# EAGLE schematic RejsaCAN v3.4 (EAGLE 9.7.0)
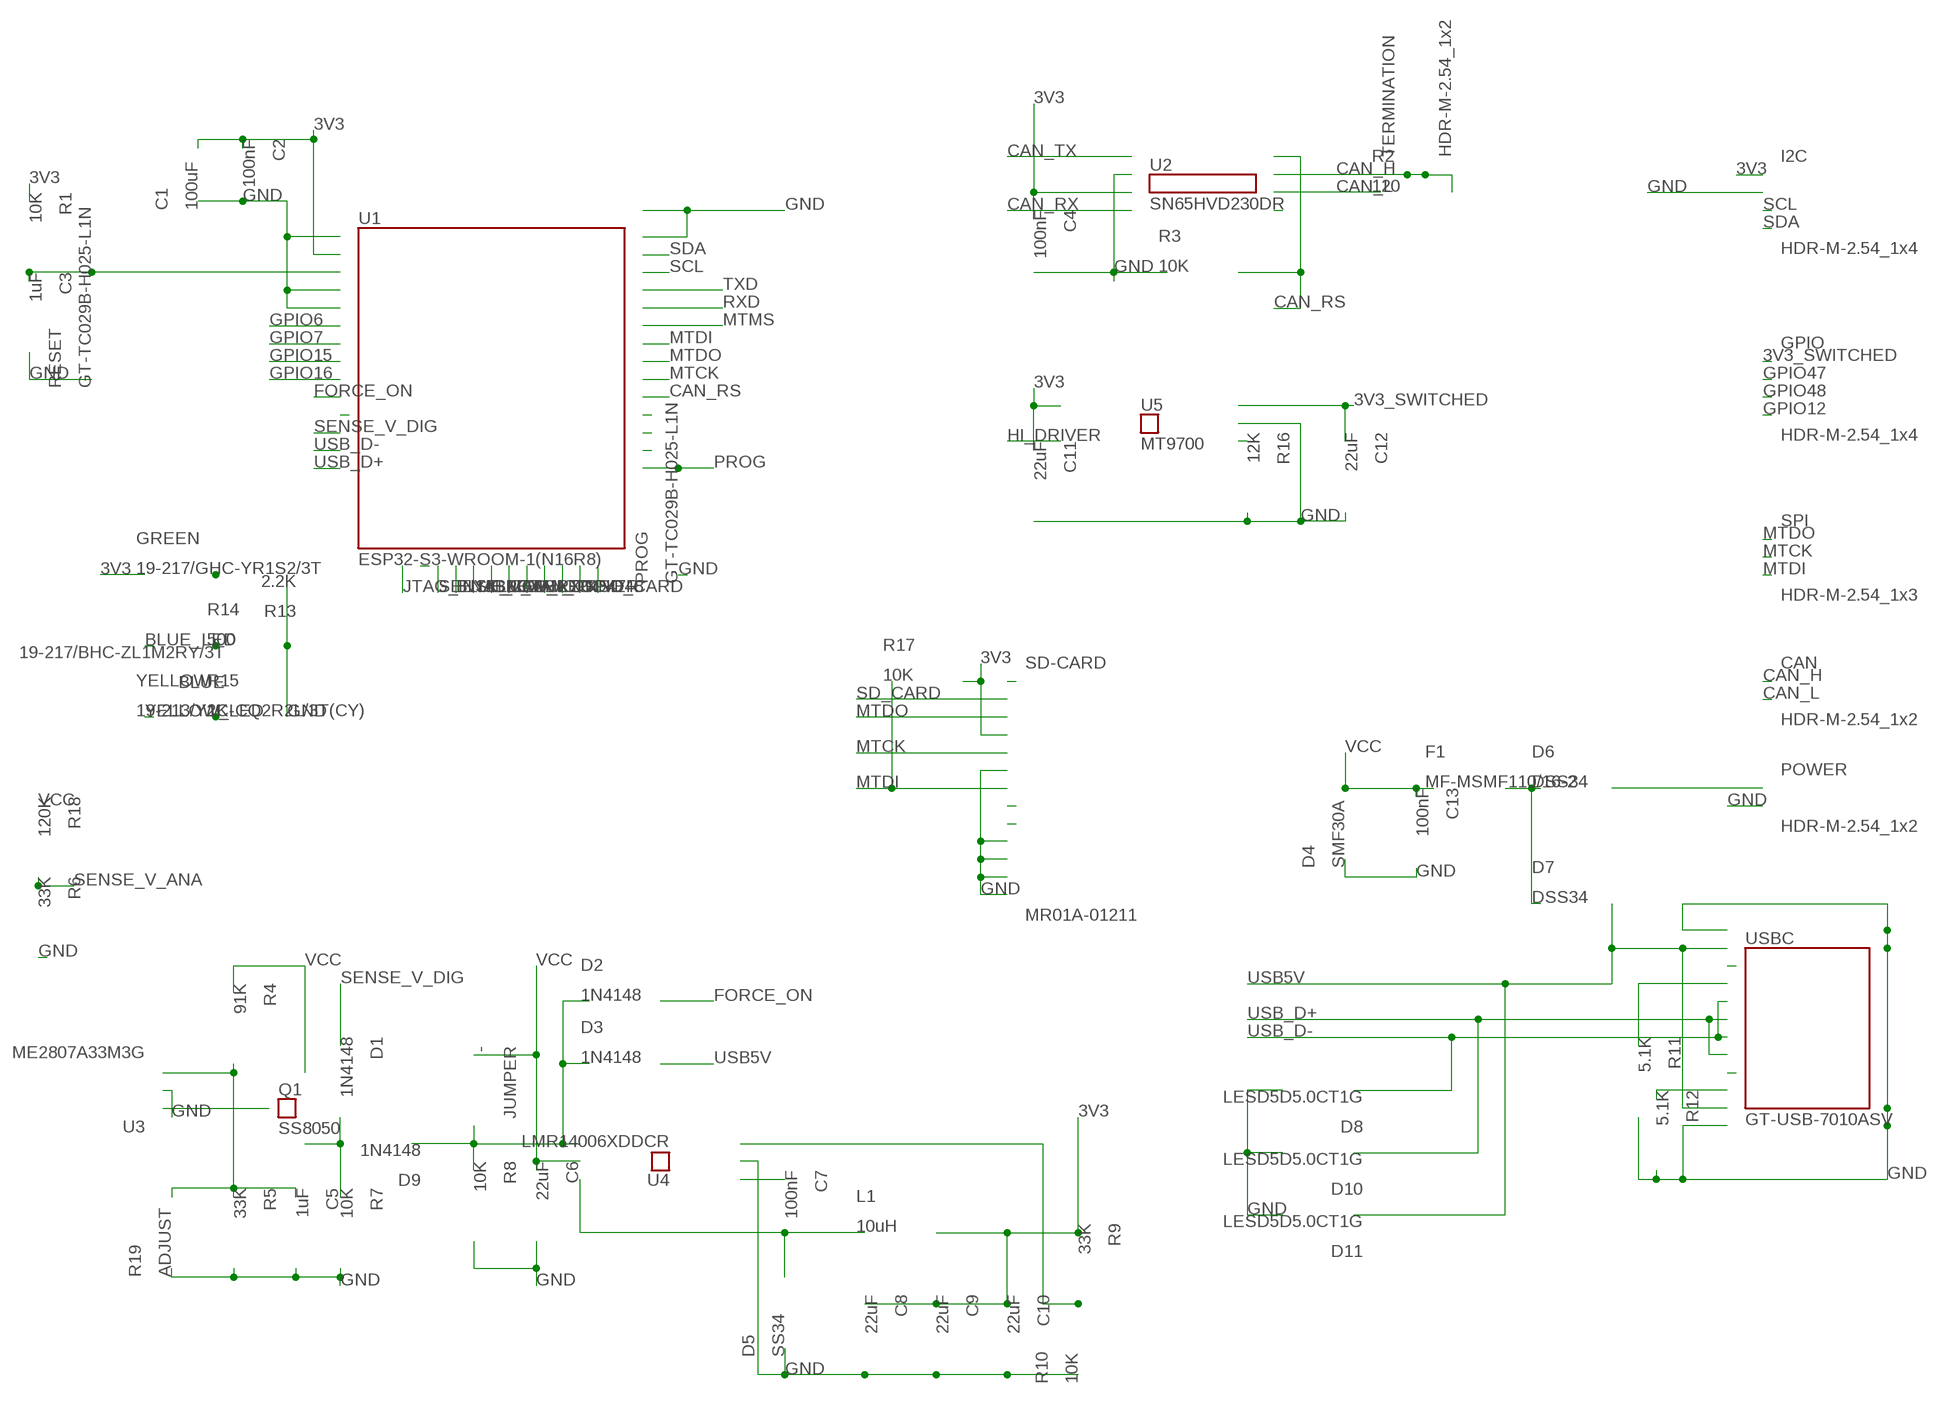
[diagram p0: schematic, sheet 1]

## Parts
BLUE  19-217/BHC-ZL1M2RY/3T  DS_BLUE  (no package)
C1  100uF  DS_C1  (no package)
C2  100nF  DS_C2  (no package)
C3  1uF  DS_C3  (no package)
C4  100nF  DS_C4  (no package)
C5  1uF  DS_C5  (no package)
C6  22uF  DS_C6  (no package)
C7  100nF  DS_C7  (no package)
C8  22uF  DS_C8  (no package)
C9  22uF  DS_C9  (no package)
C10  22uF  DS_C10  (no package)
C11  22uF  DS_C11  (no package)
C12  22uF  DS_C12  (no package)
C13  100nF  DS_C13  (no package)
CAN  HDR-M-2.54_1x2  DS_CAN  (no package)
D1  1N4148  DS_D1  (no package)
D2  1N4148  DS_D2  (no package)
D3  1N4148  DS_D3  (no package)
D4  SMF30A  DS_D4  (no package)
D5  SS34  DS_D5  (no package)
D6  DSS34  DS_D6  (no package)
D7  DSS34  DS_D7  (no package)
D8  LESD5D5.0CT1G  DS_D8  (no package)
D9  1N4148  DS_D9  (no package)
D10  LESD5D5.0CT1G  DS_D10  (no package)
D11  LESD5D5.0CT1G  DS_D11  (no package)
F1  MF-MSMF110/16-2  DS_F1  (no package)
GPIO  HDR-M-2.54_1x4  DS_GPIO  (no package)
GREEN  19-217/GHC-YR1S2/3T  DS_GREEN  (no package)
I2C  HDR-M-2.54_1x4  DS_I2C  (no package)
JUMPER  -  DS_JUMPER  (no package)
L1  10uH  DS_L1  (no package)
POWER  HDR-M-2.54_1x2  DS_POWER  (no package)
PROG  GT-TC029B-H025-L1N  DS_PROG  (no package)
Q1  SS8050  DS_Q1  (no package)
R1  10K  DS_R1  (no package)
R2  120  DS_R2  (no package)
R3  10K  DS_R3  (no package)
R4  91K  DS_R4  (no package)
R5  33K  DS_R5  (no package)
R6  33K  DS_R6  (no package)
R7  10K  DS_R7  (no package)
R8  10K  DS_R8  (no package)
R9  33K  DS_R9  (no package)
R10  10K  DS_R10  (no package)
R11  5.1K  DS_R11  (no package)
R12  5.1K  DS_R12  (no package)
R13  2.2K  DS_R13  (no package)
R14  500  DS_R14  (no package)
R15  1K  DS_R15  (no package)
R16  12K  DS_R16  (no package)
R17  10K  DS_R17  (no package)
R18  120K  DS_R18  (no package)
R19  ADJUST  DS_R19  (no package)
RESET  GT-TC029B-H025-L1N  DS_RESET  (no package)
SD-CARD  MR01A-01211  DS_SD-CARD  (no package)
SPI  HDR-M-2.54_1x3  DS_SPI  (no package)
TERMINATION  HDR-M-2.54_1x2  DS_TERMINATION  (no package)
U1  ESP32-S3-WROOM-1(N16R8)  DS_U1  (no package)
U2  SN65HVD230DR  DS_U2  (no package)
U3  ME2807A33M3G  DS_U3  (no package)
U4  LMR14006XDDCR  DS_U4  (no package)
U5  MT9700  DS_U5  (no package)
USBC  GT-USB-7010ASV  DS_USBC  (no package)
YELLOW  19-213/Y2C-CQ2R2L/3T(CY)  DS_YELLOW  (no package)

## Nets
3V3: C1.1 C2.2 C4.2 C8.2 C9.2 C10.2 C11.2 GREEN.1 I2C.1 L1.2 R1.2 R9.2 R17.2 SD-CARD.4 U1.2 U2.3 U5.5
3V3_SWITCHED: C12.2 GPIO.1 U5.1
BLUE_LED: BLUE.1 U1.18
CAN_H: CAN.1 R2.2 TERMINATION.1 TERMINATION.2 U2.7
CAN_L: CAN.2 R2.1 U2.6
CAN_RS: R3.2 U1.31 U2.8
CAN_RX: U1.21 U2.4
CAN_TX: U1.22 U2.1
FORCE_ON: D2.2 U1.10
GND: C1.2 C2.1 C3.1 C4.1 C5.1 C6.1 C8.1 C9.1 C10.1 C11.1 C12.1 C13.1 D4.2 D5.2 D8.2 D10.2 D11.2 I2C.2 POWER.2 PROG.2 R3.1 R5.1 R6.1 R7.1 R8.1 R10.2 R11.1 R12.1 R13.1 R14.2 R15.2 R16.1 R19.2 RESET.2 SD-CARD.6 SD-CARD.10 SD-CARD.11 SD-CARD.12 SD-CARD.13 U1.1 U1.4 U1.5 U1.40 U1.41 U2.2 U3.2 U4.2 U5.2 USBC.1 USBC.2 USBC.3 USBC.4 USBC.A1B12 USBC.B1A12
GPIO6: U1.6
GPIO7: U1.7
GPIO12: GPIO.4 U1.20
GPIO15: U1.8
GPIO16: U1.9
GPIO47: GPIO.2 U1.24
GPIO48: GPIO.3 U1.25
HI_DRIVER: U1.23 U5.4
JTAG_ENABLE: U1.15
MTCK: SD-CARD.5 SPI.2 U1.32
MTDI: R17.1 SD-CARD.7 SPI.3 U1.34
MTDO: SD-CARD.3 SPI.1 U1.33
MTMS: U1.35
N$1: R15.1 YELLOW.2
N$2: D6.2 POWER.1
N$3: BLUE.2 R14.1
N$4: GREEN.2 R13.2
N$5: D1.1 D9.2 Q1.2 R7.2
N$6: C5.2 R4.1 R5.2 R19.1 U3.3
N$7: Q1.1 U3.1
N$8: C7.1 D5.1 L1.1 U4.6
N$9: R16.2 U5.3
N$10: R9.1 R10.1 U4.3
N$11: D2.1 D3.1 D9.1 JUMPER.1 R8.2 U4.4
N$12: C3.2 R1.1 RESET.1 U1.3
N$13: U2.5
N$14: D6.1 D7.1 F1.2
N$15: SD-CARD.1
N$16: SD-CARD.8
N$17: SD-CARD.9
N$18: U1.11
N$19: U1.16
N$20: U1.28
N$21: U1.29
N$22: U1.30
N$23: C7.2 U4.1
N$24: R12.2 USBC.B5
N$25: USBC.A8
N$26: R11.2 USBC.A5
N$27: USBC.B8
PROG: PROG.1 U1.27
RXD: U1.36
SCL: I2C.3 U1.38
SD_CARD: SD-CARD.2 U1.26
SDA: I2C.4 U1.39
SENSE_V_ANA: R6.2 R18.1 U1.17
SENSE_V_DIG: D1.2 U1.12
TXD: U1.37
USB5V: D3.2 D7.2 D11.1 USBC.A4B9 USBC.B4A9
USB_D+: D10.1 U1.14 USBC.A6 USBC.B6
USB_D-: D8.1 U1.13 USBC.A7 USBC.B7
VCC: C6.2 C13.2 D4.1 F1.1 JUMPER.2 Q1.3 R4.2 R18.2 U4.5
YELLOW_LED: U1.19 YELLOW.1

## Library data of the parts
BLUE = rejsacan_synth:DS_BLUE: 19-217/BHC-ZL1M2RY/3T
C1 = rejsacan_synth:DS_C1: TAJB107K006RNJ
C2 = rejsacan_synth:DS_C2: CL05B104KO5NNNC
C3 = rejsacan_synth:DS_C3: CL05A105KA5NQNC
C4 = rejsacan_synth:DS_C4: CL05B104KO5NNNC
C5 = rejsacan_synth:DS_C5: CL05A105KA5NQNC
C6 = rejsacan_synth:DS_C6: CL21A226MAYNNNE
C7 = rejsacan_synth:DS_C7: CL05B104KO5NNNC
C8 = rejsacan_synth:DS_C8: CL10A226MQ8NRNC
C9 = rejsacan_synth:DS_C9: CL10A226MQ8NRNC
C10 = rejsacan_synth:DS_C10: CL10A226MQ8NRNC
C11 = rejsacan_synth:DS_C11: CL10A226MQ8NRNC
C12 = rejsacan_synth:DS_C12: CL10A226MQ8NRNC
C13 = rejsacan_synth:DS_C13: CL05B104KB54PNC
CAN = rejsacan_synth:DS_CAN: HDR-M-2.54_1x2
D1 = rejsacan_synth:DS_D1: 1N4148WS T4
D2 = rejsacan_synth:DS_D2: 1N4148WS T4
D3 = rejsacan_synth:DS_D3: 1N4148WS T4
D4 = rejsacan_synth:DS_D4: SMF30A
D5 = rejsacan_synth:DS_D5: SS34
D6 = rejsacan_synth:DS_D6: DSS34
D7 = rejsacan_synth:DS_D7: DSS34
D8 = rejsacan_synth:DS_D8: LESD5D5.0CT1G
D9 = rejsacan_synth:DS_D9: 1N4148WS T4
D10 = rejsacan_synth:DS_D10: LESD5D5.0CT1G
D11 = rejsacan_synth:DS_D11: LESD5D5.0CT1G
F1 = rejsacan_synth:DS_F1: MF-MSMF110/16-2
GPIO = rejsacan_synth:DS_GPIO: HDR-M-2.54_1x4
GREEN = rejsacan_synth:DS_GREEN: 19-217/GHC-YR1S2/3T
I2C = rejsacan_synth:DS_I2C: HDR-M-2.54_1x4
JUMPER = rejsacan_synth:DS_JUMPER: -
L1 = rejsacan_synth:DS_L1: SLP6028S100MTT
POWER = rejsacan_synth:DS_POWER: HDR-M-2.54_1x2
PROG = rejsacan_synth:DS_PROG: GT-TC029B-H025-L1N
Q1 = rejsacan_synth:DS_Q1: SS8050
R1 = rejsacan_synth:DS_R1: 0402WGF1002TCE
R2 = rejsacan_synth:DS_R2: RTT061200FTP
R3 = rejsacan_synth:DS_R3: 0402WGF1002TCE
R4 = rejsacan_synth:DS_R4: 0402WGF9102TCE
R5 = rejsacan_synth:DS_R5: 0402WGF3302TCE
R6 = rejsacan_synth:DS_R6: 0402WGF3302TCE
R7 = rejsacan_synth:DS_R7: 0402WGF1002TCE
R8 = rejsacan_synth:DS_R8: 0402WGF1002TCE
R9 = rejsacan_synth:DS_R9: 0402WGF3302TCE
R10 = rejsacan_synth:DS_R10: 0402WGF1002TCE
R11 = rejsacan_synth:DS_R11: 0402WGF5101TCE
R12 = rejsacan_synth:DS_R12: 0402WGF5101TCE
R13 = rejsacan_synth:DS_R13: 0402WGF2201TCE
R14 = rejsacan_synth:DS_R14: 0402WGF4700TCE
R15 = rejsacan_synth:DS_R15: 0402WGF1001TCE
R16 = rejsacan_synth:DS_R16: 0402WGF1202TCE
R17 = rejsacan_synth:DS_R17: 0402WGF1002TCE
R18 = rejsacan_synth:DS_R18: 0402WGF1203TCE
R19 = rejsacan_synth:DS_R19: 0402WGF9102TCE
RESET = rejsacan_synth:DS_RESET: GT-TC029B-H025-L1N
SD-CARD = rejsacan_synth:DS_SD-CARD: MR01A-01211
SPI = rejsacan_synth:DS_SPI: HDR-M-2.54_1x3
TERMINATION = rejsacan_synth:DS_TERMINATION: HDR-M-2.54_1x2
U1 = rejsacan_synth:DS_U1: ESP32-S3-WROOM-1(N16R8)
U2 = rejsacan_synth:DS_U2: SN65HVD230DR
U3 = rejsacan_synth:DS_U3: ME2807A33M3G
U4 = rejsacan_synth:DS_U4: LMR14006XDDCR
U5 = rejsacan_synth:DS_U5: MT9700
USBC = rejsacan_synth:DS_USBC: GT-USB-7010ASV
YELLOW = rejsacan_synth:DS_YELLOW: 19-213/Y2C-CQ2R2L/3T(CY)